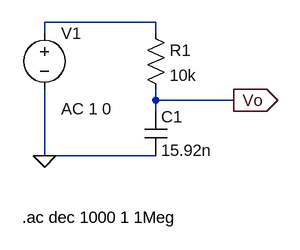
[diagram p0: schematic q2.asc]
q2.asc, the LTspice schematic file:
Version 4
SHEET 1 880 680
WIRE 192 48 32 48
WIRE 32 64 32 48
WIRE 192 64 192 48
WIRE 192 160 192 144
WIRE 304 160 192 160
WIRE 192 176 192 160
WIRE 32 240 32 144
WIRE 192 240 32 240
FLAG 304 160 Vo
IOPIN 304 160 Out
FLAG 32 240 0
SYMBOL res 176 48 R0
SYMATTR InstName R1
SYMATTR Value 10k
SYMBOL cap 176 176 R0
SYMATTR InstName C1
SYMATTR Value 15.92n
SYMBOL voltage 32 48 R0
WINDOW 123 24 124 Left 2
WINDOW 39 0 0 Left 0
SYMATTR Value2 AC 1 0
SYMATTR InstName V1
SYMATTR Value ""
TEXT 0 328 Left 2 !.ac dec 1000 1 1Meg

The netlist it stands for:
* q2.asc
R1 N001 Vo 10k
C1 Vo 0 15.92n
V1 N001 0 AC 1 0
.ac dec 1000 1 1Meg
.backanno
.end